# Altium schematic sheet STM_IC.SchDoc
size Letter
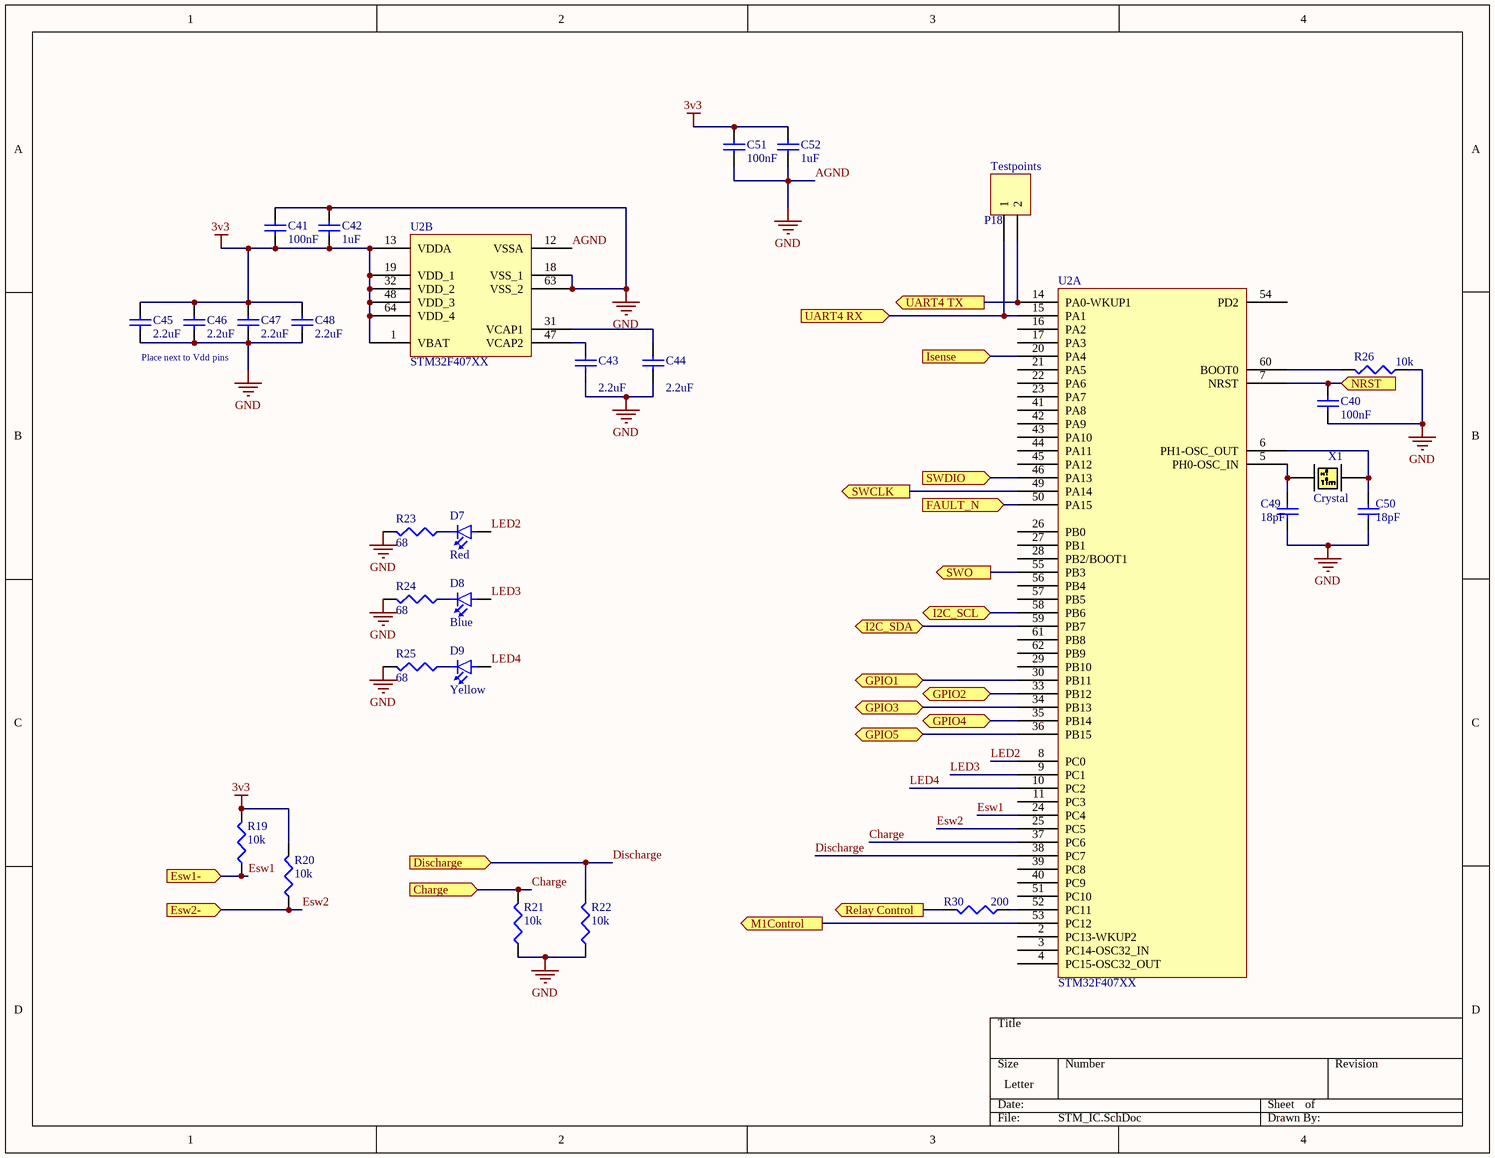
[diagram p0: STM_IC.SchDoc]

## Parts
C40  value 100nF  [SMD0603]  (hidden comment: Cap)
C41  value 100nF  [SMD0603]  (hidden comment: Cap)
C42  value 1uF  [SMD0603]  (hidden comment: Cap)
C43  value 2.2uF  [SMD0603]  (hidden comment: Cap)
C44  value 2.2uF  [SMD0603]  (hidden comment: Cap)
C45  value 2.2uF  [SMD0603]  (hidden comment: Cap)
C46  value 2.2uF  [SMD0603]  (hidden comment: Cap)
C47  value 2.2uF  [SMD0603]  (hidden comment: Cap)
C48  value 2.2uF  [SMD0603]  (hidden comment: Cap)
C49  value 18pF  [SMD0603]  (hidden comment: Cap)
C50  value 18pF  [SMD0603]  (hidden comment: Cap)
C51  value 100nF  [SMD0603]  (hidden comment: Cap)
C52  value 1uF  [SMD0603]  (hidden comment: Cap)
D7  Color: Red  [SMD0805_LED]  (hidden comment: LED)
D8  Color: Blue  [SMD0805_LED]  (hidden comment: LED)
D9  Color: Yellow  [SMD0805_LED]  (hidden comment: LED)
P18  Testpoints  [Header 2x1]
R19  value 10k  [SMD0603]  (hidden comment: Res)
R20  value 10k  [SMD0603]  (hidden comment: Res)
R21  value 10k  [SMD0603]  (hidden comment: Res)
R22  value 10k  [SMD0603]  (hidden comment: Res)
R23  value 68  [SMD0603]  (hidden comment: Res)
R24  value 68  [SMD0603]  (hidden comment: Res)
R25  value 68  [SMD0603]  (hidden comment: Res)
R26  value 10k  [SMD0603]  (hidden comment: Res)
R30  value 200  [SMD0603]  (hidden comment: Res)
U2  STM32F407XX  [LQFP64]  (parts A,B of 2)
X1  Crystal  [ABMM2-OSC]

## Ports
Charge (in), Discharge (in), Esw1- (in), Esw2- (in), FAULT_N (in), GPIO1 (bidir), GPIO2 (bidir), GPIO3 (bidir), GPIO4 (bidir), GPIO5 (bidir), I2C_SCL (bidir), I2C_SDA (bidir), Isense (in), M1Control (out), NRST (in), Relay Control (out), SWCLK (out), SWDIO (in), SWO (out), UART4 RX (in), UART4 TX (out)

## Nets
3v3: C41.1 C42.1 C45.2 C46.2 C47.2 C48.2 C51.2 C52.2 R19.2 R20.2 U2.1(VBAT) U2.13(VDDA) U2.19(VDD_1) U2.32(VDD_2) U2.48(VDD_3) U2.64(VDD_4)
AGND: C40.1 C41.2 C42.2 C43.1 C44.1 C45.1 C46.1 C47.1 C48.1 C49.1 C50.1 C51.1 C52.1 R21.1 R22.1 R23.2 R24.2 R25.2 R26.1 U2.12(VSSA) U2.18(VSS_1) U2.63(VSS_2)  [also labelled GND]
Charge: R21.2 U2.37(PC6) ; port Charge
Discharge: R22.2 U2.38(PC7) ; port Discharge
Esw1: R19.1 U2.24(PC4) ; port Esw1-
Esw2: R20.1 U2.25(PC5) ; port Esw2-
FAULT_N: U2.50(PA15) ; port FAULT_N
GPIO1: U2.30(PB11) ; port GPIO1
GPIO2: U2.33(PB12) ; port GPIO2
GPIO3: U2.34(PB13) ; port GPIO3
GPIO4: U2.35(PB14) ; port GPIO4
GPIO5: U2.36(PB15) ; port GPIO5
I2C_SCL: U2.58(PB6) ; port I2C_SCL
I2C_SDA: U2.59(PB7) ; port I2C_SDA
Isense: U2.20(PA4) ; port Isense
LED2: D7.1(Anode_(+)) U2.8(PC0)
LED3: D8.1(Anode_(+)) U2.9(PC1)
LED4: D9.1(Anode_(+)) U2.10(PC2)
M1Control: U2.53(PC12) ; port M1Control
NRST: C40.2 U2.7(NRST) ; port NRST
Relay Control: R30.2 ; port Relay Control
SWCLK: U2.49(PA14) ; port SWCLK
SWDIO: U2.46(PA13) ; port SWDIO
SWO: U2.55(PB3) ; port SWO
UART4 RX: P18.1 U2.15(PA1) ; port UART4 RX
UART4 TX: P18.2 U2.14(PA0-WKUP1) ; port UART4 TX
NetC43_2: C43.2 U2.47(VCAP2)
NetC44_2: C44.2 U2.31(VCAP1)
NetC49_2: C49.2 U2.5(PH0-OSC_IN) X1.1
NetC50_2: C50.2 U2.6(PH1-OSC_OUT) X1.2
NetD7_2: D7.2(Cathode_(-)) R23.1
NetD8_2: D8.2(Cathode_(-)) R24.1
NetD9_2: D9.2(Cathode_(-)) R25.1
NetR26_2: R26.2 U2.60(BOOT0)
NetR30_1: R30.1 U2.52(PC11)

Not connected (* = marked no-connect by the designer): U2 2(PC13-WKUP2) 3(PC14-OSC32_IN) 4(PC15-OSC32_OUT) 11(PC3) 16(PA2) 17(PA3) 21(PA5) 22(PA6) 23(PA7) 26(PB0) 27(PB1) 28(PB2/BOOT1) 29(PB10) 39(PC8) 40(PC9) 41(PA8) 42(PA9) 43(PA10) 44(PA11) 45(PA12) 51(PC10) 54(PD2) 56(PB4) 57(PB5) 61(PB8) 62(PB9)

## Notes on the sheet
- Place next to Vdd pins

## Library data of the parts
C40-C52 = Capacitor Ceramic: Ceramic Chip Capacitor
P18 = Header 2x1: Header, 2-Pin
R19-R26 R30 = Resistor
U2 = STM32F407_LQFP64